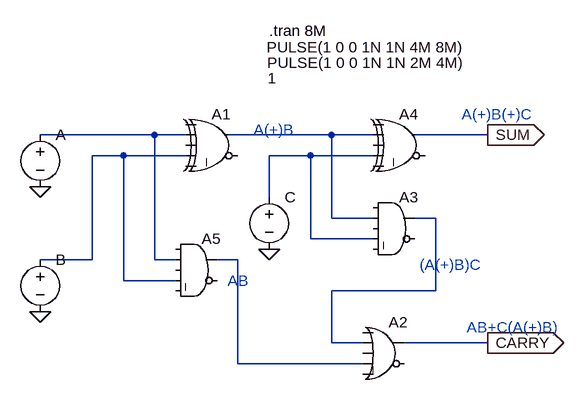
[diagram p0: schematic FULL ADDER2.asc]
FULL ADDER2.asc, the LTspice schematic file:
Version 4
SHEET 1 880 680
WIRE 64 80 -112 80
WIRE 112 80 64 80
WIRE 336 80 176 80
WIRE 400 80 336 80
WIRE 576 80 464 80
WIRE 16 112 -32 112
WIRE 112 112 16 112
WIRE 304 112 240 112
WIRE 400 112 304 112
WIRE 240 176 240 112
WIRE 336 208 336 80
WIRE 400 208 336 208
WIRE 496 208 464 208
WIRE 304 240 304 112
WIRE 400 240 304 240
WIRE -32 272 -32 112
WIRE -32 272 -112 272
WIRE 64 272 64 80
WIRE 96 272 64 272
WIRE 192 272 160 272
WIRE 16 304 16 112
WIRE 96 304 16 304
WIRE 496 320 496 208
WIRE 496 320 336 320
WIRE 336 400 336 320
WIRE 384 400 336 400
WIRE 576 400 448 400
WIRE 192 432 192 272
WIRE 384 432 192 432
FLAG -112 160 0
FLAG -112 352 0
FLAG 240 256 0
FLAG 576 80 SUM
IOPIN 576 80 Out
FLAG 576 400 CARRY
IOPIN 576 400 Out
SYMBOL voltage -112 64 R0
WINDOW 3 348 -119 Left 2
WINDOW 123 0 0 Left 0
WINDOW 39 0 0 Left 0
SYMATTR Value PULSE(1 0 0 1N 1N 4M 8M)
SYMATTR InstName A
SYMBOL voltage -112 256 R0
WINDOW 3 349 -287 Left 2
WINDOW 123 0 0 Left 0
WINDOW 39 0 0 Left 0
SYMATTR Value PULSE(1 0 0 1N 1N 2M 4M)
SYMATTR InstName B
SYMBOL voltage 240 160 R0
WINDOW 3 -2 -167 Left 2
WINDOW 123 0 0 Left 0
WINDOW 39 0 0 Left 0
SYMATTR Value 1
SYMATTR InstName C
SYMBOL Digital\\xor 160 32 R0
SYMATTR InstName A1
SYMBOL Digital\\or 416 352 R0
SYMATTR InstName A2
SYMBOL Digital\\and 432 160 R0
SYMATTR InstName A3
SYMBOL Digital\\xor 448 32 R0
SYMATTR InstName A4
SYMBOL Digital\\and 128 224 R0
SYMATTR InstName A5
TEXT 240 -80 Left 2 !.tran 8M
TEXT 216 72 Left 2 ;A(+)B
TEXT 536 48 Left 2 ;A(+)B(+)C
TEXT 176 304 Left 2 ;AB
TEXT 472 280 Left 2 ;(A(+)B)C
TEXT 544 376 Left 2 ;AB+C(A(+)B)

The netlist it stands for:
* FULL ADDER2.asc
V§A N001 0 PULSE(1 0 0 1N 1N 4M 8M)
V§B N003 0 PULSE(1 0 0 1N 1N 2M 4M)
V§C N004 0 1
A1 0 N001 0 N003 0 0 N002 0 XOR
A2 0 N005 0 N006 0 0 CARRY 0 OR
A3 0 N002 0 N004 0 0 N005 0 AND
A4 0 N002 0 N004 0 0 SUM 0 XOR
A5 0 N001 0 N003 0 0 N006 0 AND
.tran 8M
* A(+)B
* A(+)B(+)C
* AB
* (A(+)B)C
* AB+C(A(+)B)
.backanno
.end

* Results of the author's LTspice run, read from the files saved beside the schematic
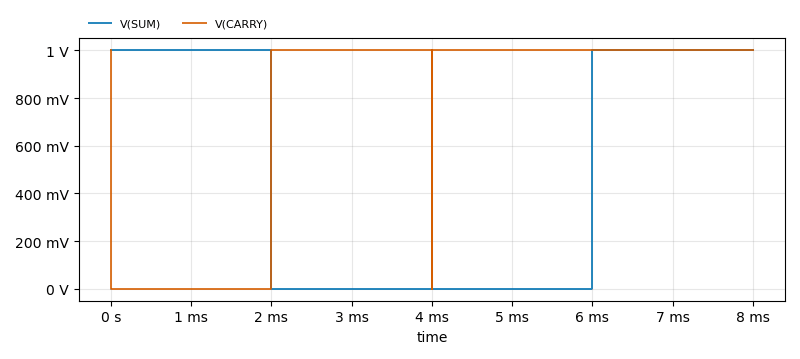
[diagram p1: Transient Analysis of FULL ADDER2.asc, plotted from the saved traces]
* Transient Analysis, 1 run:
*   V(SUM): min 0 V, max 1 V, average 500 mV, rms 707.1 mV, last 1 V
*   V(CARRY): min 0 V, max 1 V, average 750 mV, rms 866 mV, last 1 V